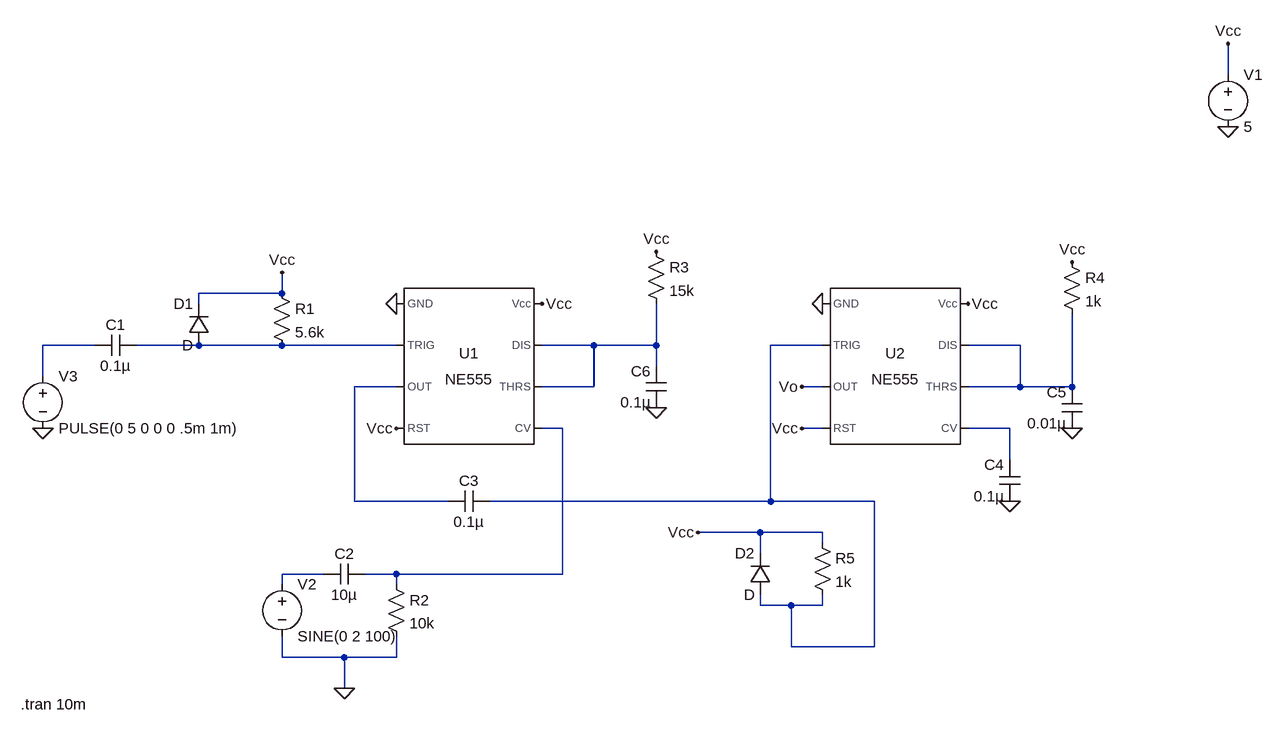
[diagram p0: schematic PPM.asc]
PPM.asc, the LTspice schematic file:
Version 4
SHEET 1 1448 680
WIRE 1392 -352 1392 -400
WIRE -64 -16 -64 -48
WIRE -64 -16 -192 -16
WIRE -192 0 -192 -16
WIRE -352 64 -432 64
WIRE -192 64 -288 64
WIRE -64 64 -192 64
WIRE 112 64 -64 64
WIRE 416 64 336 64
WIRE 512 64 512 0
WIRE 512 64 416 64
WIRE 768 64 688 64
WIRE 1072 64 992 64
WIRE 512 96 512 64
WIRE -432 112 -432 64
WIRE 112 128 48 128
WIRE 416 128 416 64
WIRE 416 128 336 128
WIRE 768 128 736 128
WIRE 1072 128 1072 64
WIRE 1072 128 992 128
WIRE 1152 128 1152 16
WIRE 1152 128 1072 128
WIRE 368 192 336 192
WIRE 768 192 736 192
WIRE 1056 192 992 192
WIRE 1056 240 1056 192
WIRE 48 304 48 128
WIRE 192 304 48 304
WIRE 688 304 688 64
WIRE 688 304 256 304
WIRE 848 304 688 304
WIRE 672 352 576 352
WIRE 768 352 672 352
WIRE 768 368 768 352
WIRE 672 384 672 352
WIRE 0 416 -64 416
WIRE 112 416 64 416
WIRE 368 416 368 192
WIRE 368 416 112 416
WIRE -64 432 -64 416
WIRE 112 432 112 416
WIRE 672 464 672 448
WIRE 720 464 672 464
WIRE 768 464 768 448
WIRE 768 464 720 464
WIRE 720 528 720 464
WIRE 848 528 848 304
WIRE 848 528 720 528
WIRE -64 544 -64 512
WIRE 32 544 -64 544
WIRE 112 544 112 512
WIRE 112 544 32 544
WIRE 32 592 32 544
FLAG 1392 -272 0
FLAG 768 0 0
FLAG 112 0 0
FLAG 512 160 0
FLAG 32 592 0
FLAG -432 192 0
FLAG 1056 304 0
FLAG 1152 192 0
FLAG 1392 -400 Vcc
FLAG 1152 -64 Vcc
FLAG 992 0 Vcc
FLAG 736 192 Vcc
FLAG 112 192 Vcc
FLAG 336 0 Vcc
FLAG 512 -80 Vcc
FLAG -64 -48 Vcc
FLAG 576 352 Vcc
FLAG 736 128 Vo
SYMBOL Misc\\NE555 224 96 R0
SYMATTR InstName U1
SYMBOL Misc\\NE555 880 96 R0
SYMATTR InstName U2
SYMBOL voltage 1392 -368 R0
WINDOW 123 0 0 Left 0
WINDOW 39 0 0 Left 0
SYMATTR InstName V1
SYMATTR Value 5
SYMBOL voltage -64 416 R0
WINDOW 123 0 0 Left 0
WINDOW 39 0 0 Left 0
SYMATTR InstName V2
SYMATTR Value SINE(0 2 100)
SYMBOL voltage -432 96 R0
WINDOW 123 0 0 Left 0
WINDOW 39 0 0 Left 0
SYMATTR InstName V3
SYMATTR Value PULSE(0 5 0 0 0 .5m 1m)
SYMBOL diode -176 64 R180
WINDOW 0 24 64 Left 2
WINDOW 3 24 0 Left 2
SYMATTR InstName D1
SYMBOL diode 688 448 R180
WINDOW 0 24 64 Left 2
WINDOW 3 24 0 Left 2
SYMATTR InstName D2
SYMBOL res -80 -32 R0
SYMATTR InstName R1
SYMATTR Value 5.6k
SYMBOL res 96 416 R0
SYMATTR InstName R2
SYMATTR Value 10k
SYMBOL res 496 -96 R0
SYMATTR InstName R3
SYMATTR Value 15k
SYMBOL res 1136 -80 R0
SYMATTR InstName R4
SYMATTR Value 1k
SYMBOL res 752 352 R0
SYMATTR InstName R5
SYMATTR Value 1k
SYMBOL cap -288 48 R90
WINDOW 0 0 32 VBottom 2
WINDOW 3 32 32 VTop 2
SYMATTR InstName C1
SYMATTR Value 0.1µ
SYMBOL cap 64 400 R90
WINDOW 0 0 32 VBottom 2
WINDOW 3 32 32 VTop 2
SYMATTR InstName C2
SYMATTR Value 10µ
SYMBOL cap 1072 304 R180
WINDOW 0 24 56 Left 2
WINDOW 3 24 8 Left 2
SYMATTR InstName C4
SYMATTR Value 0.1µ
SYMBOL cap 1168 192 R180
WINDOW 0 24 56 Left 2
WINDOW 3 24 8 Left 2
SYMATTR InstName C5
SYMATTR Value 0.01µ
SYMBOL cap 528 160 R180
WINDOW 0 24 56 Left 2
WINDOW 3 24 8 Left 2
SYMATTR InstName C6
SYMATTR Value 0.1µ
SYMBOL cap 256 288 R90
WINDOW 0 0 32 VBottom 2
WINDOW 3 32 32 VTop 2
SYMATTR InstName C3
SYMATTR Value 0.1µ
TEXT -466 616 Left 2 !.tran 10m

The netlist it stands for:
* PPM.asc
XU1 0 N002 N006 Vcc N007 N003 N003 Vcc NE555  ; pins GND TRIG OUT RST CV THRS DIS Vcc
XU2 0 N004 Vo Vcc N008 N005 N005 Vcc NE555  ; pins GND TRIG OUT RST CV THRS DIS Vcc
V1 Vcc 0 5
V2 N009 0 SINE(0 2 100)
V3 N001 0 PULSE(0 5 0 0 0 .5m 1m)
D1 N002 Vcc D
D2 N004 Vcc D
R1 Vcc N002 5.6k
R2 N007 0 10k
R3 Vcc N003 15k
R4 Vcc N005 1k
R5 Vcc N004 1k
C1 N002 N001 0.1µ
C2 N007 N009 10µ
C4 0 N008 0.1µ
C5 0 N005 0.01µ
C6 0 N003 0.1µ
C3 N004 N006 0.1µ
.model D D
.lib standard.dio
.tran 10m
.lib NE555.sub
.backanno
.end